# EAGLE schematic 1bttn-1poti (EAGLE 7.1.0)
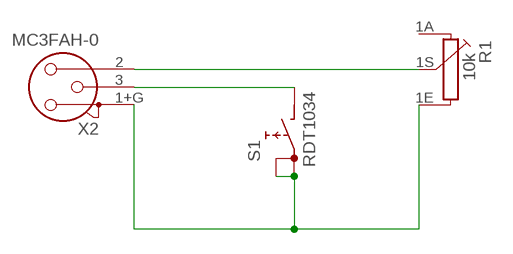
[diagram p0: schematic, sheet 1]

## Parts
R1  10k  PC16-SHM2  [PC16-SHM2]
S1  RDT1034  [RDT1034]
X2  MC3FAH-0  [NC3FAH1-0]

## Nets
N$1: R1.1S X2.2
N$2: R1.1E S1.A S1.A1 X2.1+G
N$3: S1.B X2.3
Unconnected: R1.1A R1.M1 R1.M2 R1.M3 R1.M4

## Library data of the parts
R1 = piher:PC16-SHM2: POTENTIOMETER single carbon potentiometer, 16 mm, S3ROH; OC_FARNELL: unknown; OC_NEWARK: unknown
S1 = switch:RDT1034: PUSH SWITCH www.radiohm.com
X2 = con-neutrik_ag:MC3?: Neutrik Audio Connector XLR SERIES Stereo 1/4" jack Source: www.neutrik.com/; OC_FARNELL: unknown; OC_NEWARK: unknown